# Altium schematic sheet 02_HDMI_RX.SchDoc
size OrCAD B
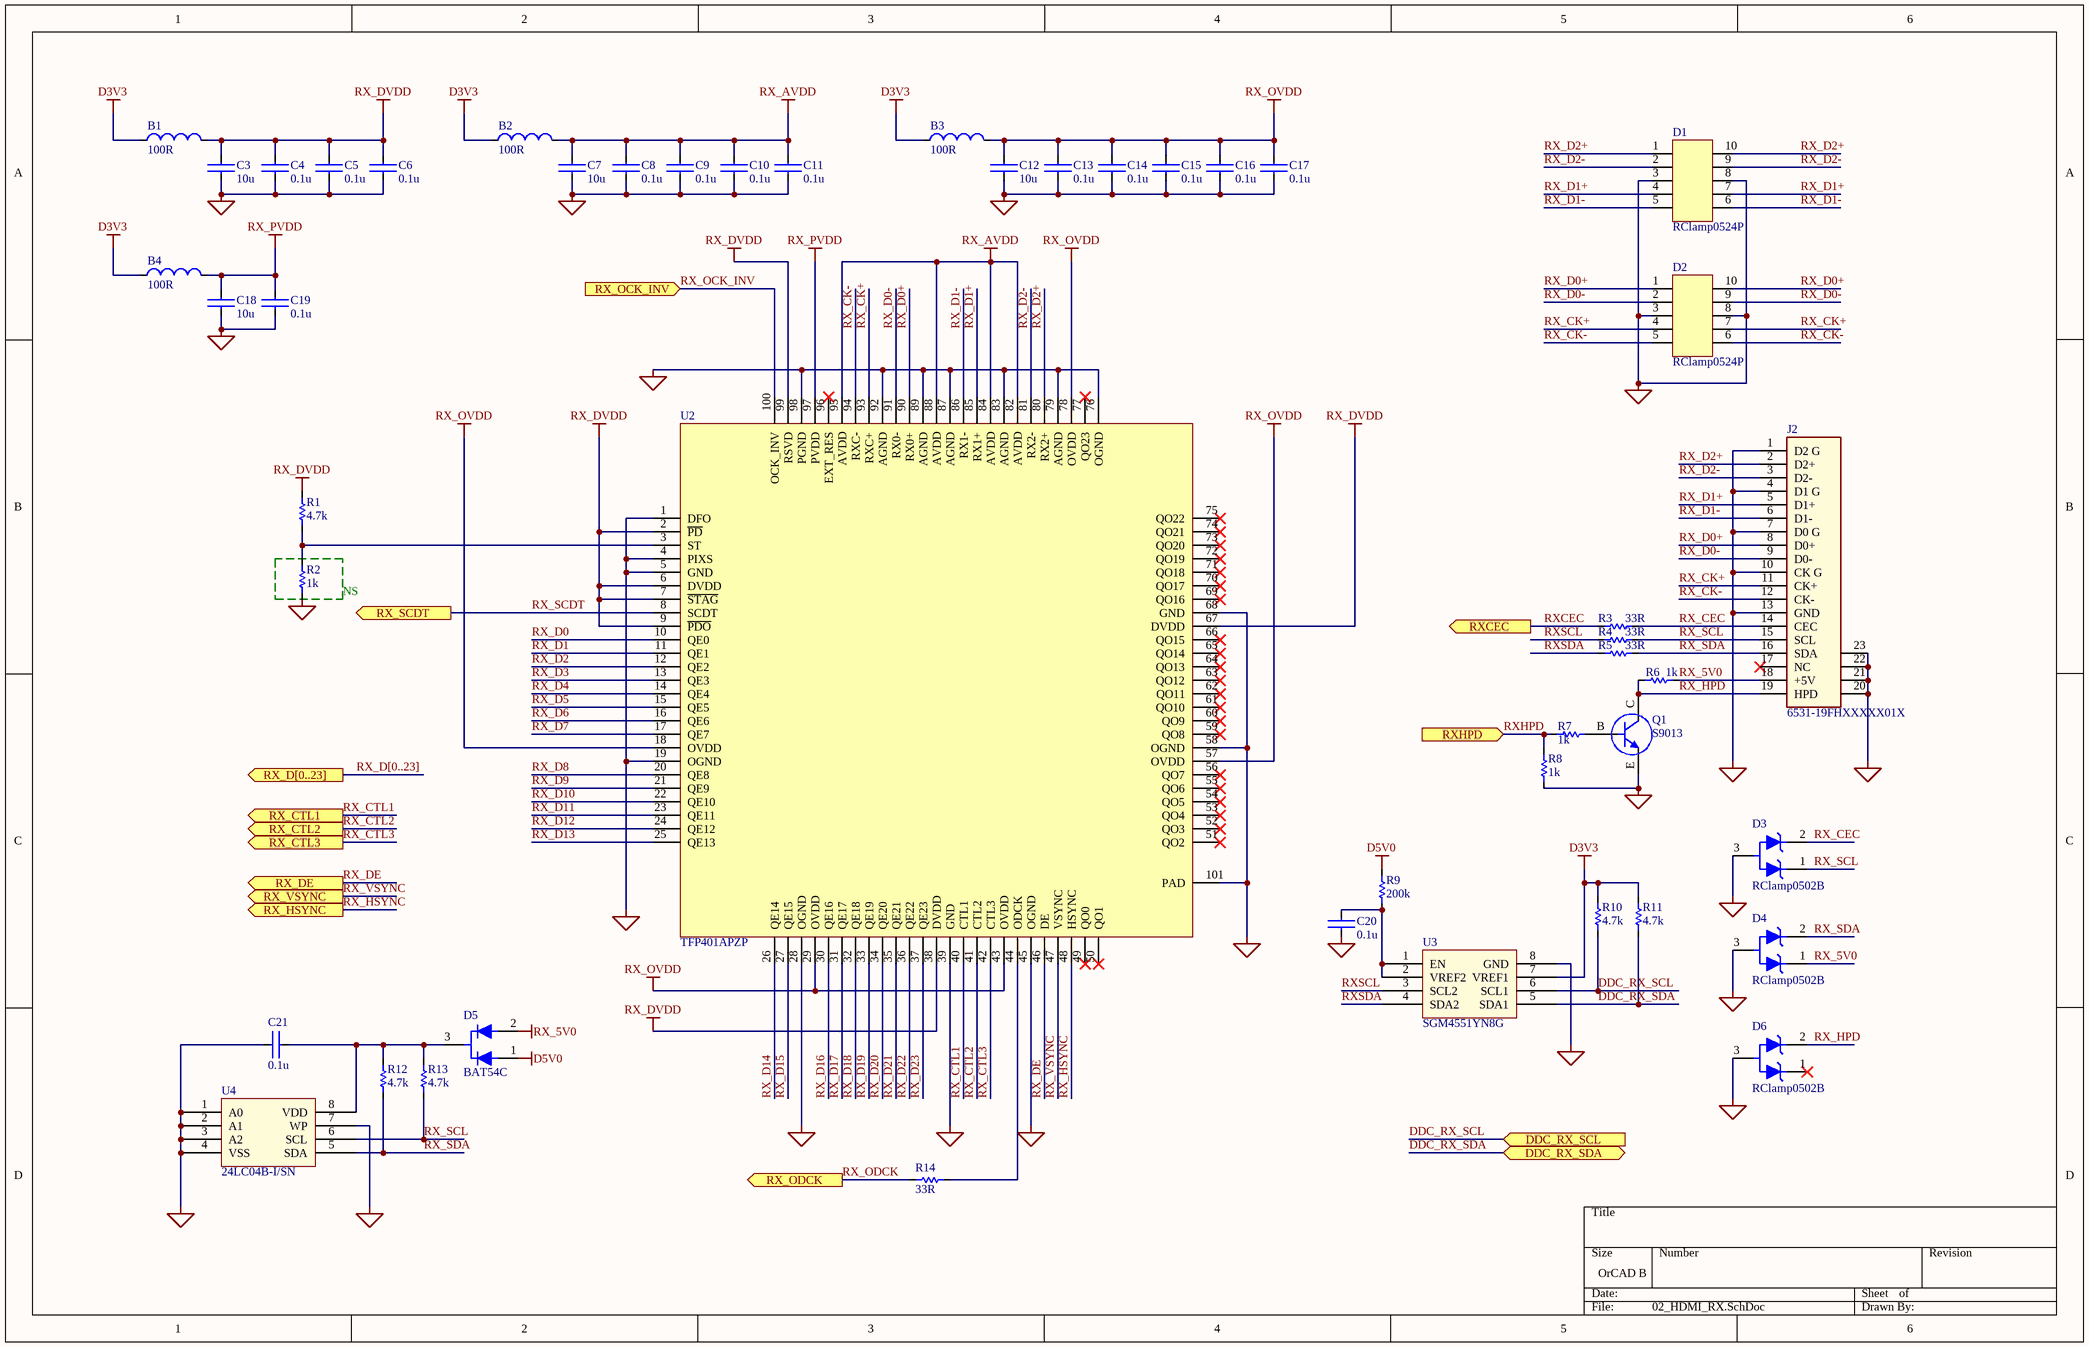
[diagram p0: 02_HDMI_RX.SchDoc]

## Parts
B1  100R  [INDC1608X09N_B0603_TAIYO]
B2  100R  [INDC1608X09N_B0603_TAIYO]
B3  100R  [INDC1608X09N_B0603_TAIYO]
B4  100R  [INDC1608X09N_B0603_TAIYO]
C3  10u  [CAPC1608X09N_C0603]
C4  0.1u  [C0402]
C5  0.1u  [C0402]
C6  0.1u  [C0402]
C7  10u  [CAPC1608X09N_C0603]
C8  0.1u  [C0402]
C9  0.1u  [C0402]
C10  0.1u  [C0402]
C11  0.1u  [C0402]
C12  10u  [CAPC1608X09N_C0603]
C13  0.1u  [C0402]
C14  0.1u  [C0402]
C15  0.1u  [C0402]
C16  0.1u  [C0402]
C17  0.1u  [C0402]
C18  10u  [CAPC1608X09N_C0603]
C19  0.1u  [C0402]
C20  0.1u  [C0402]
C21  0.1u  [C0402]
D1  RClamp0524P  [SLP2510P8_RClamp0524P]
D2  RClamp0524P  [SLP2510P8_RClamp0524P]
D3  RClamp0502B  [SOTFL50P160X90-3N_RClamp0502B]
D4  RClamp0502B  [SOTFL50P160X90-3N_RClamp0502B]
D5  BAT54C  [SOT95P230X110-3N_SOT23_BAT54]
D6  RClamp0502B  [SOTFL50P160X90-3N_RClamp0502B]
J2  6531-19FHXXXXX01X  [6531-19FHXXXXX01X]
Q1  S9013  [SOT95P240X115-3N_JCET_TRANSISTOR]
R1  4.7k  [R0402]
R2  1k  [R0402]
R3  33R  [R0402]
R4  33R  [R0402]
R5  33R  [R0402]
R6  1k  [R0402]
R7  1k  [R0402]
R8  1k  [R0402]
R9  200k  [R0402]
R10  4.7k  [R0402]
R11  4.7k  [R0402]
R12  4.7k  [R0402]
R13  4.7k  [R0402]
R14  33R  [R0402]
U2  TFP401APZP  [TSQFP50P1600X1600X120_HS-101N_TFP401]
U3  SGM4551YN8G  [TSOP65P280X125-8N_SGM4551]
U4  24LC04B-I/SN  [SOIC127P600X175-8N_24LC04B]

## Ports
DDC_RX_SCL (in), DDC_RX_SDA (bidir), RX_CTL1 (out), RX_CTL2 (out), RX_CTL3 (out), RX_D[0..23] (out), RX_DE (out), RX_HSYNC (out), RX_OCK_INV (in), RX_ODCK (out), RX_SCDT (out), RX_VSYNC (out), RXCEC (out), RXHPD (in)

## Nets
D3V3: B1.2 B2.2 B3.2 B4.2 R10.2 R11.2 U3.7(VREF1)
D5V0: D5.1 R9.2
GND: C3.2 C4.2 C5.2 C6.2 C7.2 C8.2 C9.2 C10.2 C11.2 C12.2 C13.2 C14.2 C15.2 C16.2 C17.2 C18.2 C19.2 C20.2 C21.1 D1.3 D1.8 D2.3 D2.8 D3.3 D4.3 D6.3 J2.1(D2_G) J2.4(D1_G) J2.7(D0_G) J2.10(CK_G) J2.13(GND) J2.20 J2.21 J2.22 J2.23 Q1.E R2.1 R8.1 U2.1(DFO) U2.4(PIXS) U2.5(GND) U2.19(OGND) U2.28(OGND) U2.39(GND) U2.45(OGND) U2.58(OGND) U2.68(GND) U2.76(OGND) U2.79(AGND) U2.83(AGND) U2.87(AGND) U2.89(AGND) U2.92(AGND) U2.98(PGND) U2.101(PAD) U3.8(GND) U4.1(A0) U4.2(A1) U4.3(A2) U4.4(VSS) U4.7(WP)
RX_5V0: D4.1 D5.2 J2.18(+5V) R6.1
RX_AVDD: B2.1 C7.1 C8.1 C9.1 C10.1 C11.1 U2.82(AVDD) U2.84(AVDD) U2.88(AVDD) U2.95(AVDD)
RX_DVDD: B1.1 C3.1 C4.1 C5.1 C6.1 R1.2 U2.2(~{PD}) U2.6(DVDD) U2.7(~{STAG}) U2.9(~{PDO}) U2.38(DVDD) U2.67(DVDD) U2.99(RSVD)
RX_OVDD: B3.1 C12.1 C13.1 C14.1 C15.1 C16.1 C17.1 U2.18(OVDD) U2.29(OVDD) U2.43(OVDD) U2.57(OVDD) U2.78(OVDD)
RX_PVDD: B4.1 C18.1 C19.1 U2.97(PVDD)
DDC_RX_SCL: R10.1 U3.6(SCL1) ; port DDC_RX_SCL
DDC_RX_SDA: R11.1 U3.5(SDA1) ; port DDC_RX_SDA
RX_CEC: D3.2 J2.14(CEC) R3.2
RX_CK+: D2.4 D2.7 J2.11(CK+) U2.93(RXC+)
RX_CK-: D2.5 D2.6 J2.12(CK-) U2.94(RXC-)
RX_CTL1: U2.40(CTL1) ; port RX_CTL1
RX_CTL2: U2.41(CTL2) ; port RX_CTL2
RX_CTL3: U2.42(CTL3) ; port RX_CTL3
RX_D0: U2.10(QE0)
RX_D0+: D2.1 D2.10 J2.8(D0+) U2.90(RX0+)
RX_D0-: D2.2 D2.9 J2.9(D0-) U2.91(RX0-)
RX_D1: U2.11(QE1)
RX_D1+: D1.4 D1.7 J2.5(D1+) U2.85(RX1+)
RX_D1-: D1.5 D1.6 J2.6(D1-) U2.86(RX1-)
RX_D2: U2.12(QE2)
RX_D2+: D1.1 D1.10 J2.2(D2+) U2.80(RX2+)
RX_D2-: D1.2 D1.9 J2.3(D2-) U2.81(RX2-)
RX_D3: U2.13(QE3)
RX_D4: U2.14(QE4)
RX_D5: U2.15(QE5)
RX_D6: U2.16(QE6)
RX_D7: U2.17(QE7)
RX_D8: U2.20(QE8)
RX_D9: U2.21(QE9)
RX_D10: U2.22(QE10)
RX_D11: U2.23(QE11)
RX_D12: U2.24(QE12)
RX_D13: U2.25(QE13)
RX_D14: U2.26(QE14)
RX_D15: U2.27(QE15)
RX_D16: U2.30(QE16)
RX_D17: U2.31(QE17)
RX_D18: U2.32(QE18)
RX_D19: U2.33(QE19)
RX_D20: U2.34(QE20)
RX_D21: U2.35(QE21)
RX_D22: U2.36(QE22)
RX_D23: U2.37(QE23)
RX_DE: U2.46(DE) ; port RX_DE
RX_HPD: D6.2 J2.19(HPD) Q1.C R6.2
RX_HSYNC: U2.48(HSYNC) ; port RX_HSYNC
RX_OCK_INV: U2.100(OCK_INV) ; port RX_OCK_INV
RX_ODCK: R14.1 ; port RX_ODCK
RX_SCDT: U2.8(SCDT) ; port RX_SCDT
RX_SCL: D3.1 J2.15(SCL) R4.2 R13.1 U4.6(SCL)
RX_SDA: D4.2 J2.16(SDA) R5.2 R12.1 U4.5(SDA)
RX_VSYNC: U2.47(VSYNC) ; port RX_VSYNC
RXCEC: R3.1 ; port RXCEC
RXHPD: R7.2 R8.2 ; port RXHPD
RXSCL: R4.1 U3.3(SCL2)
RXSDA: R5.1 U3.4(SDA2)
NetC20_1: C20.1 R9.1 U3.1(EN) U3.2(VREF2)
NetC21_2: C21.2 D5.3 R12.2 R13.2 U4.8(VDD)
NetQ1_B: Q1.B R7.1
NetR1_1: R1.1 R2.2 U2.3(ST)
NetR14_2: R14.2 U2.44(ODCK)

Not connected (* = marked no-connect by the designer): D6 1(0)*; J2 17(NC)*; U2 49(QO0)* 50(QO1)* 51(QO2)* 52(QO3)* 53(QO4)* 54(QO5)* 55(QO6)* 56(QO7)* 59(QO8)* 60(QO9)* 61(QO10)* 62(QO11)* 63(QO12)* 64(QO13)* 65(QO14)* 66(QO15)* 69(QO16)* 70(QO17)* 71(QO18)* 72(QO19)* 73(QO20)* 74(QO21)* 75(QO22)* 77(QO23)* 96(EXT_RES)*

## Buses and harness runs
bus RX_D[0..23] = port RX_D[0..23]

## Notes on the sheet
- (near R2) NS

## Library data of the parts
B1-B4 = FBMH1608HM101-T: Bead,100R,2500mA,0.035ohm,0603; Manufacturer1: YAIYO YUDEN; Manufacturer2: *; PartNumberManufacturer2: *; PartNumberManufacturer1: FBMH1608HM101-T; UnitPrice: *; Value: 100R
C3 C7 C12 C18 = CAP113: CAP,Ceramic,X7R,10%,6.3V,10uF,0603; Manufacturer1: *; Manufacturer2: *; PartNumberManufacturer1: *; UnitPrice: *; Value: 10u
C4-C6 C8-C11 C13-C17 C19-C21 = CAP011: CAP,Ceramic,X7R,10%,16V,0.1uF,0402; Manufacturer1: *; Manufacturer2: *; PartNumberManufacturer1: *; UnitPrice: *; Value: 0.1u
D1 D2 = RClamp0524P: TVS array,0.3pF,5V,SLP2510P8; Manufacturer1: SEMTECH; Manufacturer2: *; PartNumberManufacturer1: RClamp0524P; PartNumberManufacturer2: *; UnitPrice: *
D3 D4 D6 = RClamp0502B: TVS array,1pF,5V,SC75; Manufacturer1: SEMTECH; Manufacturer2: *; PartNumberManufacturer1: RClamp0502B; PartNumberManufacturer2: *; UnitPrice: *
D5 = BAT54C: Schottky Double Diodes,30V,200mA,SOT23,a1a2k1k2; Manufacturer1: NXP; Manufacturer2: *; PartNumberManufacturer1: BAT54C; PartNumberManufacturer2: *; UnitPrice: *
J2 = 6531-19FHXXXXX01X: Header,HDMI type C,19-Pin,Right angle,0.4mm Pitch,SMD; Manufacturer1: YTCO; Manufacturer2: *; PartNumberManufacturer1: 6531-19FHXXXXX01X; PartNumberManufacturer2: *; UnitPrice: *
Q1 = S9013: TRANSISTOR,NPN,40V,500mA,SOT23; Manufacturer1: JiangSu CJ; Manufacturer2: *; PartNumberManufacturer1: S9013; PartNumberManufacturer2: *; UnitPrice: *
R1 R10-R13 = RES015: RES,4.7k,1%,1/16W,0402; Manufacturer1: *; PartNumberManufacturer2: *; Manufacturer2: *; PartNumberManufacturer1: *; Value: 4.7k; UnitPrice: *
R2 R6-R8 = RES011: RES,1k,1%,1/16W,0402; PartNumberManufacturer2: *; Manufacturer2: *; PartNumberManufacturer1: *; UnitPrice: *; Manufacturer1: *; Value: 1k
R3-R5 R14 = RES017: RES,33R,1%,1/16W,0402; Manufacturer1: *; PartNumberManufacturer2: *; Manufacturer2: *; PartNumberManufacturer1: *; Value: 33R; UnitPrice: *
R9 = RES0117: RES,200k,1%,1/16W,0402; Manufacturer1: *; PartNumberManufacturer2: *; Manufacturer2: *; PartNumberManufacturer1: *; Value: 200k; UnitPrice: *
U2 = TFP401A: IC,PanelBus Digital Receiver,HTQFP100; Manufacturer1: Ti; Manufacturer2: *; PartNumberManufacturer1: TFP401APZP; PartNumberManufacturer2: *
U3 = SGM4551YN8G: IC,I2C-bus and SMBus voltage-level translator,SOT23-8; Manufacturer1: SGM; PartNumberManufacturer1: SGM4551YN8G; Manufacturer2: *; PartNumberManufacturer2: *; UnitPrice: *
U4 = 24LC04B_01: IC,EEPROM,512X8bits,I2C,SOIC8; Manufacturer1: Microchip; PartNumberManufacturer1: 24LC04B-I/SN; Manufacturer2: *; PartNumberManufacturer2: *; UnitPrice: *